# EAGLE design OSWarrior_Mini (EAGLE 6.3)

## Sheet 1 of 3
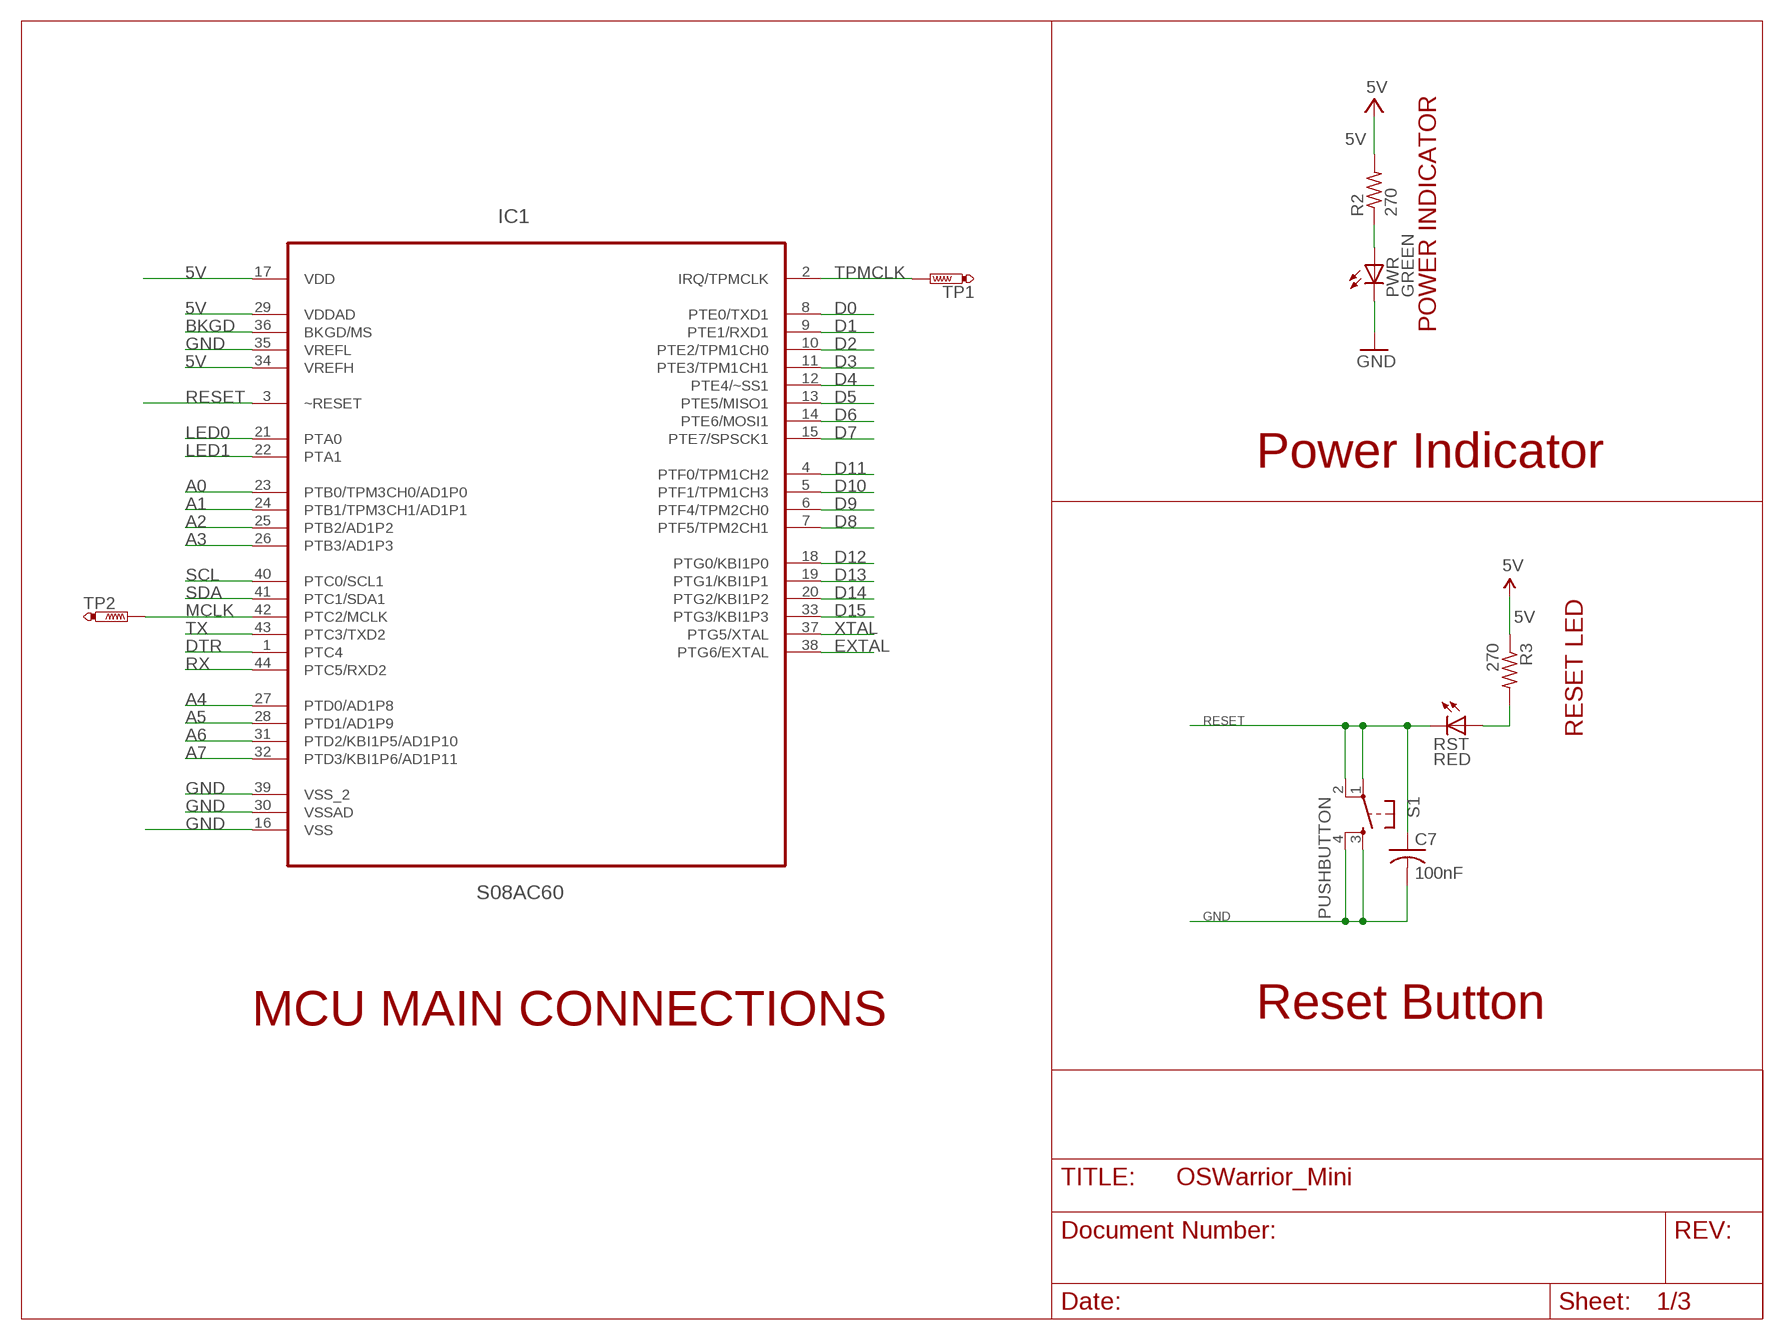
[diagram p0: schematic, sheet 1]

### Parts
C7  100nF  C-USC0805  [C0805]
IC1  S08AC60  MC9S08AC48CFGE_LQFP-44  [LQFP-44]
PWR  GREEN  LEDCHIPLED_1206  [CHIPLED_1206]
R2  270  R-US_M0805  [M0805]
R3  270  R-US_M0805  [M0805]
RST  RED  LEDCHIPLED_1206  [CHIPLED_1206]
S1  PUSHBUTTON  TAC_SWITCHPTH  [TACTILE-PTH]
TP1  PTR1B1,27  [B1,27]
TP2  PTR1B1,27  [B1,27]

### Nets
5V: IC1.17(VDD) IC1.29(VDDAD) IC1.34(VREFH) R2.2 R3.1 ; also sheet 2,3
A0: IC1.23(PTB0/TPM3CH0/AD1P0) ; also sheet 2
A1: IC1.24(PTB1/TPM3CH1/AD1P1) ; also sheet 2
A2: IC1.25(PTB2/AD1P2) ; also sheet 2
A3: IC1.26(PTB3/AD1P3) ; also sheet 2
A4: IC1.27(PTD0/AD1P8) ; also sheet 2
A5: IC1.28(PTD1/AD1P9) ; also sheet 2
A6: IC1.31(PTD2/KBI1P5/AD1P10) ; also sheet 2
A7: IC1.32(PTD3/KBI1P6/AD1P11) ; also sheet 2
BKGD: IC1.36(BKGD/MS) ; also sheet 3
D0: IC1.8(PTE0/TXD1) ; also sheet 2
D1: IC1.9(PTE1/RXD1) ; also sheet 2
D2: IC1.10(PTE2/TPM1CH0) ; also sheet 2
D3: IC1.11(PTE3/TPM1CH1) ; also sheet 2
D4: IC1.12(PTE4/~SS1) ; also sheet 2
D5: IC1.13(PTE5/MISO1) ; also sheet 2
D6: IC1.14(PTE6/MOSI1) ; also sheet 2
D7: IC1.15(PTE7/SPSCK1) ; also sheet 2
D8: IC1.7(PTF5/TPM2CH1) ; also sheet 2
D9: IC1.6(PTF4/TPM2CH0) ; also sheet 2
D10: IC1.5(PTF1/TPM1CH3) ; also sheet 2
D11: IC1.4(PTF0/TPM1CH2) ; also sheet 2
D12: IC1.18(PTG0/KBI1P0) ; also sheet 2
D13: IC1.19(PTG1/KBI1P1) ; also sheet 2
D14: IC1.20(PTG2/KBI1P2) ; also sheet 2
D15: IC1.33(PTG3/KBI1P3) ; also sheet 2
DTR: IC1.1(PTC4)
EXTAL: IC1.38(PTG6/EXTAL) ; also sheet 2
GND [gnd]: C7.2 IC1.16(VSS) IC1.30(VSSAD) IC1.35(VREFL) IC1.39(VSS_2) PWR.C S1.3 S1.4 ; also sheet 2,3
LED0: IC1.21(PTA0) ; also sheet 2
LED1: IC1.22(PTA1) ; also sheet 2
MCLK: IC1.42(PTC2/MCLK) TP2.TP
N$9: R3.2 RST.A
N$14: PWR.A R2.1
RESET: C7.1 IC1.3(~RESET) RST.C S1.1 S1.2 ; also sheet 2,3
RX: IC1.44(PTC5/RXD2) ; also sheet 3
SCL: IC1.40(PTC0/SCL1) ; also sheet 2
SDA: IC1.41(PTC1/SDA1) ; also sheet 2
TPMCLK: IC1.2(IRQ/TPMCLK) TP1.TP
TX: IC1.43(PTC3/TXD2) ; also sheet 3
XTAL: IC1.37(PTG5/XTAL) ; also sheet 2

### Notes on the sheet
- POWER INDICATOR
- Power Indicator
- RESET LED
- MCU MAIN CONNECTIONS | Reset Button

## Sheet 2 of 3
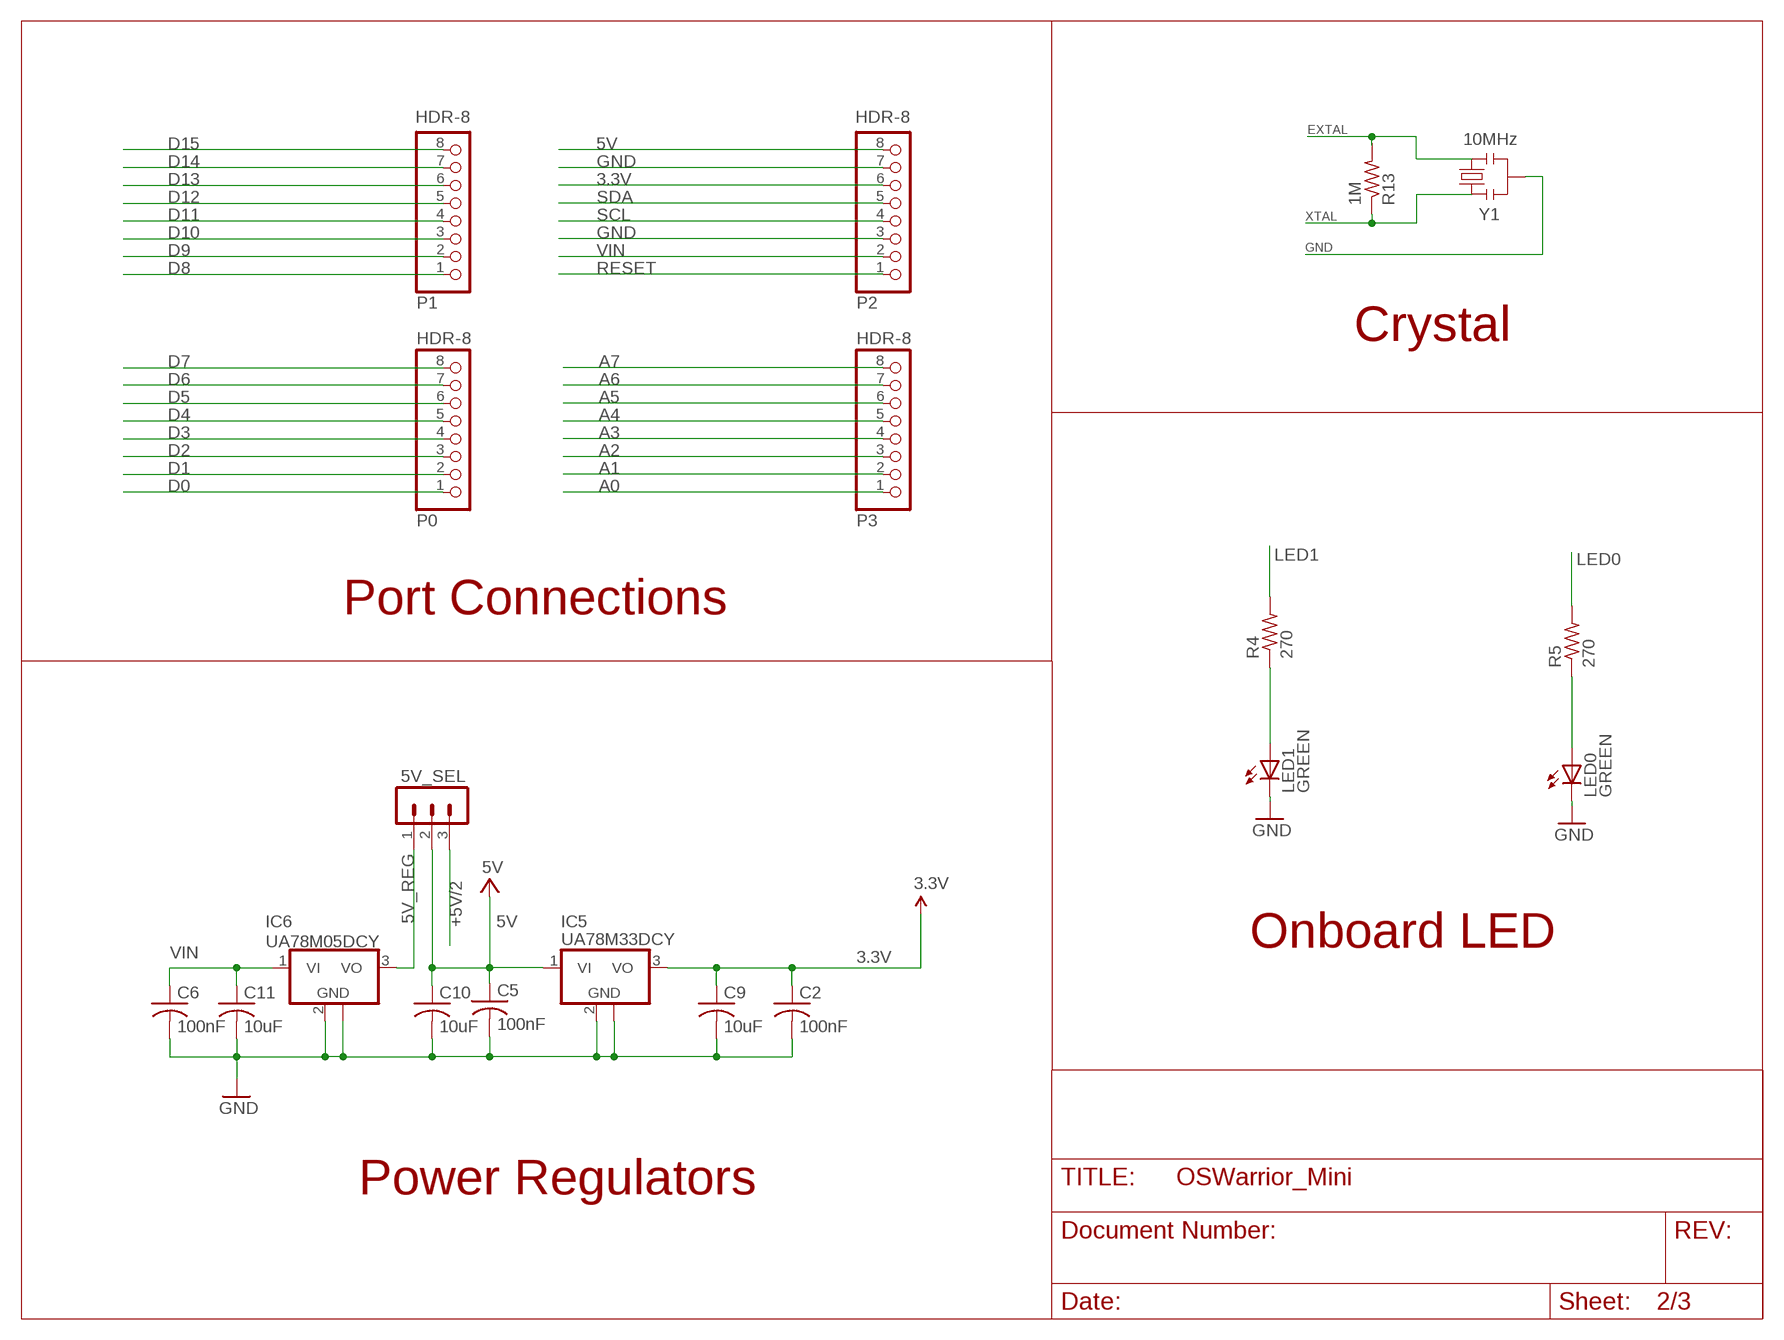
[diagram p1: schematic, sheet 2]

### Parts
5V_SEL  J1  MA03-1  [MA03-1]
C2  100nF  C-USC0805  [C0805]
C5  100nF  C-USC0805  [C0805]
C6  100nF  C-USC0805  [C0805]
C9  10uF  C-USC0805  [C0805]
C10  10uF  C-USC0805  [C0805]
C11  10uF  C-USC0805  [C0805]
IC5  UA78M33DCY  [SOT223]
IC6  UA78M05DCY  [SOT223]
LED0  GREEN  LEDCHIPLED_1206  [CHIPLED_1206]
LED1  GREEN  LEDCHIPLED_1206  [CHIPLED_1206]
P0  HDR-8  PINHD-1X8  [1X08]
P1  HDR-8  PINHD-1X8  [1X08]
P2  HDR-8  PINHD-1X8  [1X08]
P3  HDR-8  PINHD-1X8  [1X08]
R4  270  R-US_M0805  [M0805]
R5  270  R-US_M0805  [M0805]
R13  1M  R-US_M0805  [M0805]
Y1  10MHz  RESONATORSMD  [RESONATOR-SMD]

### Nets
3.3V [usbvcc]: C2.1 C9.1 IC5.3(VO) P2.6
5V: 5V_SEL.2 C5.1 C10.1 IC5.1(VI) P2.8 ; also sheet 1,3
5V_REG [usbvcc]: 5V_SEL.1 IC6.3(VO)
+5V/2: 5V_SEL.3 ; also sheet 3
A0: P3.1 ; also sheet 1
A1: P3.2 ; also sheet 1
A2: P3.3 ; also sheet 1
A3: P3.4 ; also sheet 1
A4: P3.5 ; also sheet 1
A5: P3.6 ; also sheet 1
A6: P3.7 ; also sheet 1
A7: P3.8 ; also sheet 1
D0: P0.1 ; also sheet 1
D1: P0.2 ; also sheet 1
D2: P0.3 ; also sheet 1
D3: P0.4 ; also sheet 1
D4: P0.5 ; also sheet 1
D5: P0.6 ; also sheet 1
D6: P0.7 ; also sheet 1
D7: P0.8 ; also sheet 1
D8: P1.1 ; also sheet 1
D9: P1.2 ; also sheet 1
D10: P1.3 ; also sheet 1
D11: P1.4 ; also sheet 1
D12: P1.5 ; also sheet 1
D13: P1.6 ; also sheet 1
D14: P1.7 ; also sheet 1
D15: P1.8 ; also sheet 1
EXTAL: R13.2 Y1.3 ; also sheet 1
GND [gnd]: C2.2 C5.2 C6.2 C9.2 C10.2 C11.2 IC5.2(GND) IC5.4(GND) IC6.2(GND) IC6.4(GND) LED0.C LED1.C P2.3 P2.7 Y1.2 ; also sheet 1,3
LED0: R5.2 ; also sheet 1
LED1: R4.2 ; also sheet 1
N$6: LED1.A R4.1
N$8: LED0.A R5.1
RESET: P2.1 ; also sheet 1,3
SCL: P2.4 ; also sheet 1
SDA: P2.5 ; also sheet 1
VIN [power]: C6.1 C11.1 IC6.1(VI) P2.2
XTAL: R13.1 Y1.1 ; also sheet 1

### Notes on the sheet
- Crystal
- Port Connections
- Onboard LED
- Power Regulators

## Sheet 3 of 3
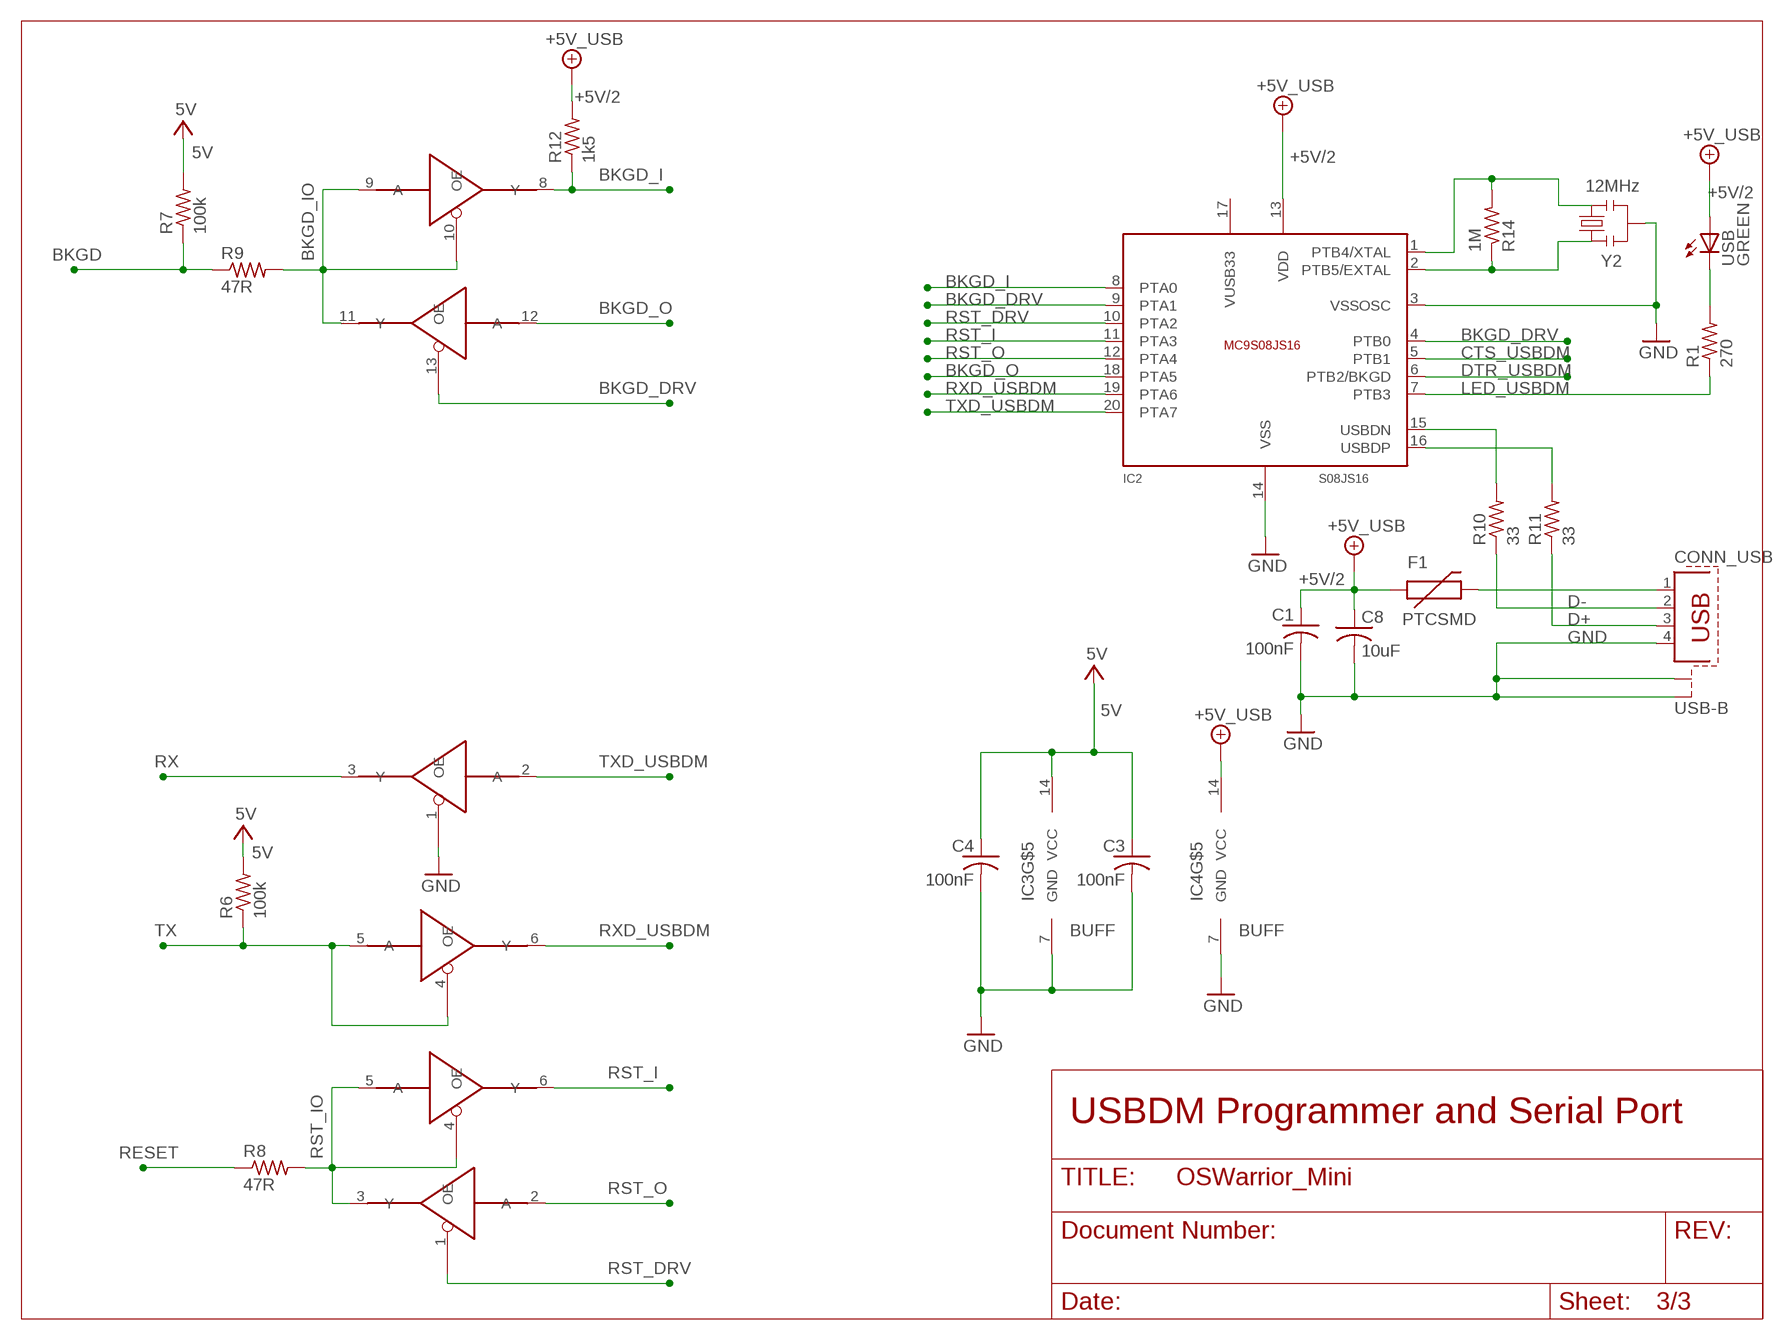
[diagram p2: schematic, sheet 3]

### Parts
C1  100nF  C-USC0805  [C0805]
C3  100nF  C-USC0805  [C0805]
C4  100nF  C-USC0805  [C0805]
C8  10uF  C-USC0805  [C0805]
CONN_USB  USB-B  PN61729-S  [PN61729-S]
F1  PTCSMD  [PTC-1206]
IC2  S08JS16  MC9S08JS16CWJ_SOIC-20  [SOIC-20]
IC3  BUFF  SN74LV125APW_TSSOP-14  [TSSOP-14]
IC4  BUFF  SN74LV125APW_TSSOP-14  [TSSOP-14]
R1  270  R-US_M0805  [M0805]
R6  100k  R-US_M0805  [M0805]
R7  100k  R-US_M0805  [M0805]
R8  47R  R-US_M0805  [M0805]
R9  47R  R-US_M0805  [M0805]
R10  33  R-US_M0805  [M0805]
R11  33  R-US_M0805  [M0805]
R12  1k5  R-US_M0805  [M0805]
R14  1M  R-US_M0805  [M0805]
USB  GREEN  LEDCHIPLED_1206  [CHIPLED_1206]
Y2  12MHz  RESONATORSMD  [RESONATOR-SMD]

### Nets
5V: C3.1 C4.1 IC3.14(VCC) R6.2 R7.2 ; also sheet 1,2
+5V/2: C1.1 C8.1 F1.1 IC2.13(VDD) IC4.14(VCC) R12.2 USB.A ; supply symbol labelled +5V_USB ; also sheet 2
BKGD: R7.1 R9.1 ; also sheet 1
BKGD_DRV: IC2.4(PTB0) IC2.9(PTA1) IC4.13(OE)
BKGD_I: IC2.8(PTA0) IC4.8(Y) R12.1
BKGD_IO: IC4.9(A) IC4.10(OE) IC4.11(Y) R9.2
BKGD_O: IC2.18(PTA5) IC4.12(A)
CTS_USBDM: IC2.5(PTB1)
D+: CONN_USB.3 R11.1
D-: CONN_USB.2 R10.1
DTR_USBDM: IC2.6(PTB2/BKGD)
GND [gnd]: C1.2 C3.2 C4.2 C8.2 CONN_USB.4 CONN_USB.S1 CONN_USB.S2 IC2.3(VSSOSC) IC2.14(VSS) IC3.1(OE) IC3.7(GND) IC4.7(GND) Y2.2 ; also sheet 1,2
LED_USBDM: IC2.7(PTB3) R1.1
N$1: R1.2 USB.C
N$2: IC2.15(USBDN) R10.2
N$3: IC2.16(USBDP) R11.2
N$4: IC2.1(PTB4/XTAL) R14.2 Y2.3
N$5: CONN_USB.1 F1.2
N$7: IC2.2(PTB5/EXTAL) R14.1 Y2.1
RESET: R8.1 ; also sheet 1,2
RST_DRV: IC2.10(PTA2) IC4.1(OE)
RST_I: IC2.11(PTA3) IC4.6(Y)
RST_IO: IC4.3(Y) IC4.4(OE) IC4.5(A) R8.2
RST_O: IC2.12(PTA4) IC4.2(A)
RX: IC3.3(Y) ; also sheet 1
RXD_USBDM: IC2.19(PTA6) IC3.6(Y)
TX: IC3.4(OE) IC3.5(A) R6.1 ; also sheet 1
TXD_USBDM: IC2.20(PTA7) IC3.2(A)
Unconnected: IC3.8(Y) IC3.9(A) IC3.10(OE) IC3.11(Y) IC3.12(A) IC3.13(OE)

### Notes on the sheet
- USBDM Programmer and Serial Port

## Power pins joined to a net without a drawn wire
VUSB33: IC2.17(VUSB33)

## Library data of the parts
5V_SEL = con-lstb:MA03-1: PIN HEADER; OC_FARNELL: unknown; OC_NEWARK: unknown
C1-C11 = resistor:C-US: CAPACITOR, American symbol
CONN_USB = con-berg:PN61729-S: BERG USB connector; OC_FARNELL: unknown; OC_NEWARK: unknown
F1 = SparkFun:PTC: Resettable Fuse PTC Resettable Fuse. Spark Fun Electronics SKU : COM-08357
IC1 = OSWarrior:MC9S08AC48CFGE_LQFP-44
IC2 = OSWarrior:MC9S08JS16CWJ_SOIC-20
IC3 IC4 = OSWarrior:SN74LV125APW_TSSOP-14
IC5 IC6 = linear:UA78M*: POSITIVE-VOLTAGE REGULATORS Source: http://focus.ti.com/lit/ds/symlink/ua78m33.pdf
LED0 LED1 PWR RST USB = led:LED: LED OSRAM: - CHIPLED LG R971, LG N971, LY N971, LG Q971, LY Q971, LO R971, LY R971 LH N974, LH R974 LS Q976, LO Q976, LY Q976 LO Q996 - Hyper CHIPLED LW Q18S LB Q993, LB Q99A, LB R99A - SideLED LS A670, LO A670, LY A670, LG A670, LP A670 LB A673, LV A673, LT A673, LW A673 LH A674 LY A675 LS A676, LA A676, LO A676, LY A676, LW A676 LS A679, LY A679, LG A679 - Hyper Micro SIDELED® LS Y876, LA Y876, LO Y876, LY Y876 LT Y87S - SmartLED LW L88C, LW L88S LB L89C, LB L89S, LG L890 LS L89K, LO L89K, LY L89K LS L896, LA L896, LO L896, LY L896 - TOPLED LS T670, LO T670, LY T670, LG T670, LP T670 LSG T670, LSP T670, LSY T670, LOP T670, LYG T670 LG T671, LOG T671, LSG T671 LB T673, LV T673, LT T673, LW T673 LH T674 LS T676, LA T676, LO T676, LY T676, LB T676, LH T676, LSB T676, LW T676 LB T67C, LV T67C, LT T67C, LS T67K, LO T67K, LY T67K, LW E67C LS E67B, LA E67B, LO E67B, LY E67B, LB E67C, LV E67C, LT E67C LW T67C LS T679, LY T679, LG T679 LS T770, LO T770, LY T770, LG T770, LP T770 LB T773, LV T773, LT T773, LW T773 LH T774 LS E675, LA E675, LY E675, LS T675 LS T776, LA T776, LO T776, LY T776, LB T776 LHGB T686 LT T68C, LB T68C - Hyper Mini TOPLED® LB M676 - Mini TOPLED Santana® LG M470 LS M47K, LO M47K, LY M47K Source: http://www.osram.convergy.de LUXEON: - LUMILED® LXK2-PW12-R00, LXK2-PW12-S00, LXK2-PW14-U00, LXK2-PW14-V00 LXK2-PM12-R00, LXK2-PM12-S00, LXK2-PM14-U00 LXK2-PE12-Q00, LXK2-PE12-R00, LXK2-PE12-S00, LXK2-PE14-T00, LXK2-PE14-U00 LXK2-PB12-K00, LXK2-PB12-L00, LXK2-PB12-M00, LXK2-PB14-N00, LXK2-PB14-P00, LXK2-PB14-Q00 LXK2-PR12-L00, LXK2-PR12-M00, LXK2-PR14-Q00, LXK2-PR14-R00 LXK2-PD12-Q00, LXK2-PD12-R00, LXK2-PD12-S00 LXK2-PH12-R00, LXK2-PH12-S00 LXK2-PL12-P00, LXK2-PL12-Q00, LXK2-PL12-R00 Source: www.luxeon.com KINGBRIGHT: KA-3528ASYC Source: www.kingbright.com
P0 P1-P3 = pinhead:PINHD-1X8: PIN HEADER
R1-R14 = resistor:R-US_: RESISTOR, American symbol
S1 = SparkFun:TAC_SWITCH: Momentary Switch Button commonly used for reset or general input. Spark Fun Electronics SKU : COM-00097
TP1 TP2 = testpad:PTR1: TEST PIN
Y1 Y2 = SparkFun:RESONATOR: Resonator Small SMD resonator. This is the itty bitty 10/20MHz resonators with built in caps. CSTCE10M0G55 and CSTCE20M0V53. Footprint has been reviewed closely but hasn't been tested yet.

## Net classes
0 default: width 0.406 mm
1 power: width 0.61 mm, drill 0.61 mm, clearance 0.254 mm
2 gnd: width 0.305 mm, drill 0.559 mm, clearance 0.254 mm
3 usbvcc: width 0.508 mm, drill 0.61 mm, clearance 0.254 mm
4 aref: width 0.406 mm, drill 0.61 mm, clearance 0.254 mm

## Board
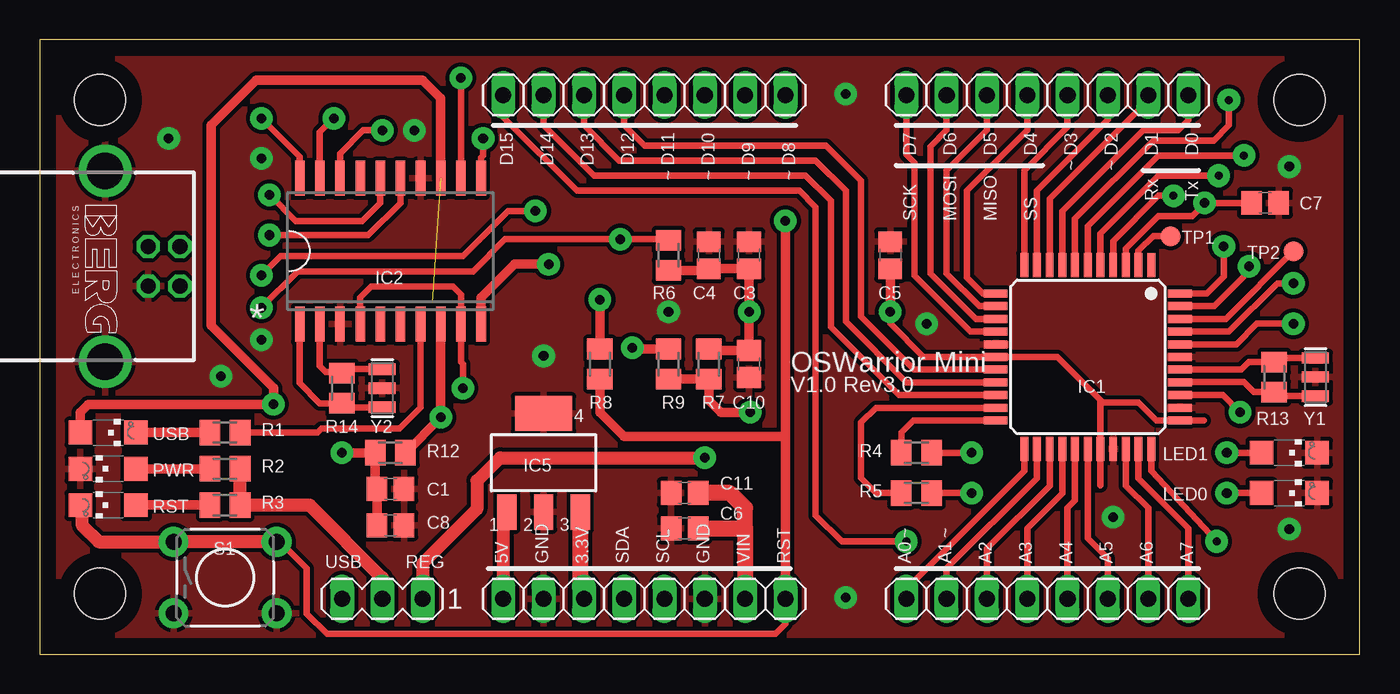
[diagram p3: board, top side]
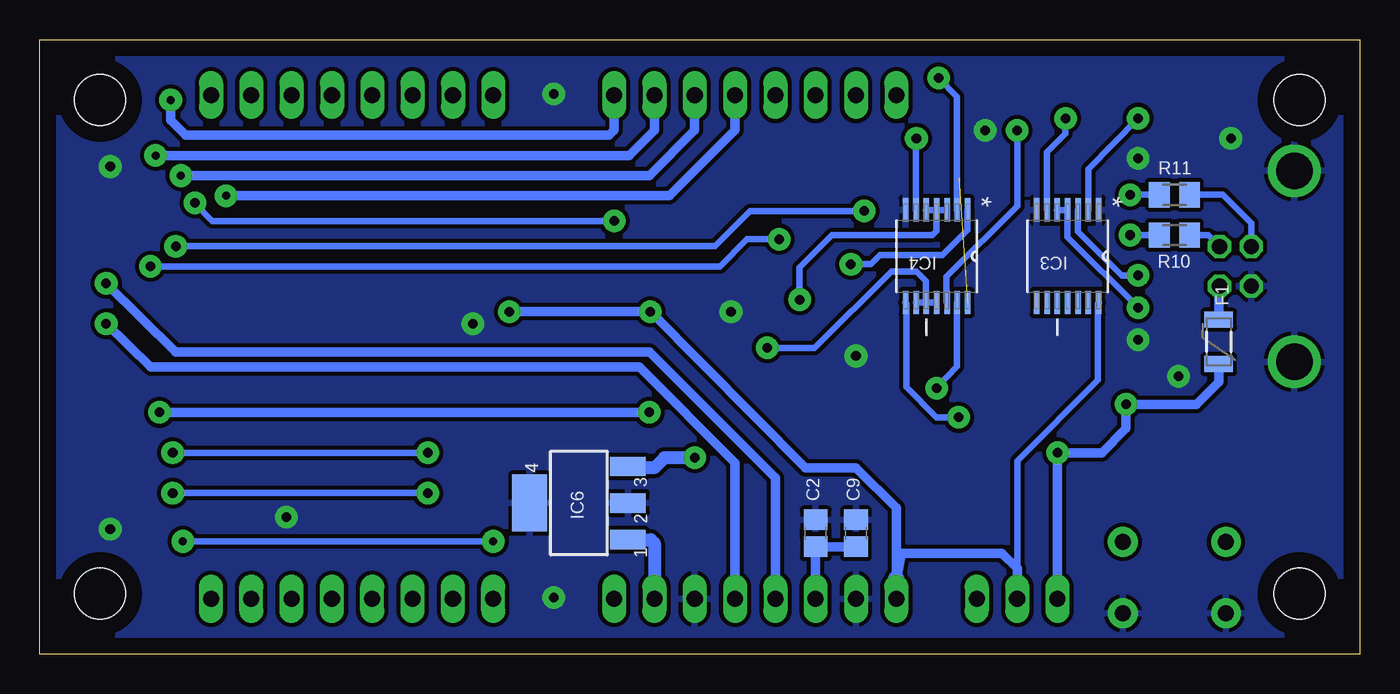
[diagram p4: board, bottom side, seen from below]

Size 83.19 x 38.73 mm. Coordinates in mm from the lower left corner, seen from the top.
Outline: 0,0 83.19,0 83.19,38.73 0,38.73 0,0
Copper layers (1*16): Top 0.035mm / dielectric 1.5mm / Bottom 0.035mm
Design rules "default": minimum track width 10mil, minimum drill 24mil, track to track 8mil, track to pad 8mil, pad to pad 8mil, via to via 8mil, smd to smd 8mil, copper to edge 40mil, drill to drill 8mil, minimum pad ring 10mil, minimum via ring 8mil, stop-mask expansion 4mil, vias tented up to drill 0mil, thermal gap 10mil
Holes 3.2 mm at 3.81,3.81 79.38,3.81 3.81,34.92 79.38,34.92

### Footprints (pad centres in the part's own frame; a part is rotated, then mirrored left to right if it is on the bottom)
MA03-1 = drill 1.016 long: 1 -2.54,0; 2 0,0; 3 2.54,0
C0805 = smd 1.3 x 1.5: 1 -0.85,0; 2 0.85,0
PN61729-S = drill 0.95 octagon: 1 1.25,4.71; 2 -1.25,4.71; 3 -1.25,2.71; 4 1.25,2.71 | drill 2.3 pad 2.9: S1 -6.02,0; S2 6.02,0
PTC-1206 = smd 1 x 1.8: 1 -1.4,0; 2 1.4,0
LQFP-44 = smd 1.5 x 0.5: 1 -5.8,4; 2 -5.8,3.2; 3 -5.8,2.4; 4 -5.8,1.6; 5 -5.8,0.8; 6 -5.8,0; 7 -5.8,-0.8; 8 -5.8,-1.6; 9 -5.8,-2.4; 10 -5.8,-3.2; 11 -5.8,-4; 23 5.8,-4; 24 5.8,-3.2; 25 5.8,-2.4; 26 5.8,-1.6; 27 5.8,-0.8; 28 5.8,0; 29 5.8,0.8; 30 5.8,1.6; 31 5.8,2.4; 32 5.8,3.2; 33 5.8,4 | smd 0.5 x 1.5: 12 -4,-5.8; 13 -3.2,-5.8; 14 -2.4,-5.8; 15 -1.6,-5.8; 16 -0.8,-5.8; 17 0,-5.8; 18 0.8,-5.8; 19 1.6,-5.8; 20 2.4,-5.8; 21 3.2,-5.8; 22 4,-5.8; 34 4,5.8; 35 3.2,5.8; 36 2.4,5.8; 37 1.6,5.8; 38 0.8,5.8; 39 0,5.8; 40 -0.8,5.8; 41 -1.6,5.8; 42 -2.4,5.8; 43 -3.2,5.8; 44 -4,5.8
SOIC-20 = smd 0.6 x 2.2: 1 -5.715,-4.6; 2 -4.445,-4.6; 3 -3.175,-4.6; 4 -1.905,-4.6; 5 -0.635,-4.6; 6 0.635,-4.6; 7 1.905,-4.6; 8 3.175,-4.6; 9 4.445,-4.6; 10 5.715,-4.6; 11 5.715,4.6; 12 4.445,4.6; 13 3.175,4.6; 14 1.905,4.6; 15 0.635,4.6; 16 -0.635,4.6; 17 -1.905,4.6; 18 -3.175,4.6; 19 -4.445,4.6; 20 -5.715,4.6
TSSOP-14 = smd 1.473 x 0.356: 1 -2.921,1.956; 2 -2.921,1.295; 3 -2.921,0.66; 4 -2.921,0; 5 -2.921,-0.66; 6 -2.921,-1.295; 7 -2.921,-1.956; 8 2.921,-1.956; 9 2.921,-1.295; 10 2.921,-0.66; 11 2.921,0; 12 2.921,0.66; 13 2.921,1.295; 14 2.921,1.956
SOT223 = smd 1.219 x 2.235: 1 -2.311,-3.099; 2 0,-3.099; 3 2.311,-3.099 | smd 3.6 x 2.2: 4 0,3.099
CHIPLED_1206 = smd 1.5 x 1.5: A 0,-1.75; C 0,1.75
1X08 = drill 1.016 long: 1 -8.89,0; 2 -6.35,0; 3 -3.81,0; 4 -1.27,0; 5 1.27,0; 6 3.81,0; 7 6.35,0; 8 8.89,0
M0805 = smd 1.3 x 1.6: 1 -0.95,0; 2 0.95,0
TACTILE-PTH = drill 1.016 pad 1.88: 1 -3.251,2.261; 2 3.251,2.261; 3 -3.251,-2.261; 4 3.251,-2.261
B1,27 = smd 1.27 x 1.27: TP 0,0
RESONATOR-SMD = smd 0.7 x 1.7: 1 -1.2,0; 2 0,0; 3 1.2,0

### Placement (x,y rotation side)
5V_SEL  21.59,3.49 180 top
C1  22.1,10.41 0 top
C2  34.29,7.62 90 bottom
C3  44.7,25.15 90 top
C4  42.16,25.15 90 top
C5  53.59,25.15 90 top
C6  40.64,7.94 180 top
C7  77.22,28.45 0 top
C8  22.1,8.13 0 top
C9  31.75,7.62 90 bottom
C10  44.7,18.29 270 top
C11  40.64,10.16 180 top
CONN_USB  4.13,24.45 270 top
F1  8.89,19.68 90 bottom
IC1  66.04,18.73 270 top
IC2  22.1,25.4 0 top
IC3  18.41,25.08 270 bottom
IC4  26.67,25.08 270 bottom
IC5  31.75,12.06 0 top
IC6  49.21,9.53 90 bottom
LED0  78.74,10.16 270 top
LED1  78.74,12.7 270 top
P0  63.5,35.24 180 top
P1  38.1,35.24 180 top
P2  38.1,3.49 180 top
P3  63.5,3.49 0 top
PWR  4.32,11.68 90 top
R1  11.68,13.97 180 top
R2  11.68,11.68 0 top
R3  11.68,9.4 180 top
R4  55.24,12.7 180 top
R5  55.24,10.16 180 top
R6  39.62,25.15 270 top
R7  42.16,18.29 90 top
R8  35.31,18.29 90 top
R9  39.62,18.29 90 top
R10  11.68,26.42 180 bottom
R11  11.68,28.96 180 bottom
R12  22.1,12.7 180 top
R13  77.79,17.46 90 top
R14  19.05,16.76 270 top
RST  4.32,9.4 90 top
S1  11.68,4.83 0 top
TP1  71.25,26.35 0 top
TP2  78.99,25.4 0 top
USB  4.32,13.97 270 top
Y1  80.39,17.46 90 top
Y2  21.59,16.76 270 top

### Tracks (layer width: path | path; a pad name or v marks a point on that pad's centre or on a via)
3.3V
  Top 1.016: IC5.3 34.06,3.72 P2.6
  Bottom 0.61: C9.1 C2.1 P2.6
5V  (via drill 0.6 pad 1.42)
  Top 0.406: 66.84,14.45 IC1.29 | 66.84,16.03 64.14,18.73 IC1.17 55.69,18.73 53.59,20.83 v53.59,21.59 | 66.84,16.03 IC1.29 | 73.34,14.73 IC1.34 70.36,14.73 69.22,15.88 66.99,15.88 66.84,16.03 | 66.84,10.63 IC1.29
  Top 0.61: R7.2 42.26,19.14 C10.1 v44.7,21.59 C3.1 C4.1 42.06,24.2 R6.2 | C5.1 v53.59,21.59
  Top 0.813: IC5.1 29.21,8.01 P2.8 | 5V_SEL.2 21.59,4.83 17.02,9.4 R3.1 R2.2
  Bottom 0.406: IC3.14 16.51,22.11 16.51,17.27 21.59,12.19 5V_SEL.2
  Bottom 0.61: P2.8 29.21,9.21 31.75,11.75 34.92,11.75 v44.7,21.59 v53.59,21.59 | 5V_SEL.2 21.59,5.4 22.54,6.35 28.89,6.35 29.21,4.76
  Bottom 1.016: 29.21,4.76 P2.8
5V_REG  (via drill 0.6 pad 1.42)
  Top 0.813: v41.91,12.38 29.02,12.38 27.56,10.92 27.56,9.14 24.13,5.71 5V_SEL.1
  Bottom 0.813: v41.91,12.38 43.81,12.38 44.45,11.75 46.34,11.75 IC6.3
+5V/2  (via drill 0.6 pad 1.42)  (1 unrouted)
  Top 0.61: v19.05,12.7 R12.2 21.15,10.51 C1.1 C8.1 | USB.A 2.54,14.51 2.54,15.24 3.05,15.75 v14.73,15.75 14.73,16.76 10.79,20.7 10.79,33.34 13.65,36.2 24.13,36.2 25.27,35.05 IC2.13
  Bottom 0.61: 5V_SEL.3 v19.05,12.7 16.26,12.7 14.73,14.22 v14.73,15.75 10.29,15.75 8.89,17.14 F1.1
A0
  Top 0.406: P3.1 54.61,4.13 62.04,11.56 IC1.23
A1
  Top 0.406: P3.2 57.15,5.4 62.84,11.09 IC1.24
A2
  Top 0.406: P3.3 59.69,6.67 63.64,10.62 IC1.25
A3
  Top 0.406: P3.4 62.23,7.94 64.44,10.15 IC1.26
A4
  Top 0.406: P3.5 64.77,9.21 65.24,9.68 IC1.27
A5
  Top 0.406: IC1.28 66.04,7.3 67.31,6.03 P3.6
A6
  Top 0.406: P3.7 69.85,9.21 68.44,10.62 IC1.31
A7
  Top 0.406: P3.8 72.39,7.94 69.24,11.09 IC1.32
BKGD  (via drill 0.6 pad 1.42)
  Top 0.406: IC1.36 74.54,16.33 v75.63,15.24
  Top 0.61: v44.77,15.24 42.93,15.24 42.16,16 R7.1 R9.1
  Bottom 0.61: v75.63,15.24 v44.77,15.24
BKGD_DRV  (via drill 0.6 pad 1.42)
  Top 0.406: v26.67,16.76 26.67,18.29 26.54,18.41 IC2.9 26.54,22.67 26.04,23.18 20.89,23.18 20.19,22.48 IC2.4
  Bottom 0.406: IC4.13 25.38,18.12 v26.67,16.76
BKGD_I  (via drill 0.6 pad 1.42)
  Top 0.61: R12.1 v25.27,14.93 IC2.8
  Bottom 0.406: IC4.8 28.57,22.11 28.57,16.83 26.67,14.93 v25.27,14.93
BKGD_IO  (via drill 0.6 pad 1.42)
  Top 0.61: v37.34,19.3 37.4,19.24 R9.2
  Bottom 0.406: IC4.9 IC4.10 | IC4.10 IC4.11 | IC4.10 27.33,23.52 27.94,24.13 29.53,24.13 34.35,19.3 v37.34,19.3
BKGD_O  (via drill 0.6 pad 1.42)
  Top 0.406: v21.59,33.02 20.38,33.02 18.92,31.56 IC2.18
  Bottom 0.406: IC4.12 26.04,22.19 26.04,23.81 21.59,28.26 v21.59,33.02
D0
  Top 0.406: 72.39,34.3 P0.1 72.39,33.66 71.75,33.02 69.53,33.02 64.44,27.93 IC1.8
D1
  Top 0.406: IC1.9 63.64,28.71 69.85,34.92 P0.2
D2
  Top 0.406: IC1.10 62.84,29.21 67.31,33.68 P0.3
D3
  Top 0.406: IC1.11 62.04,30.48 64.77,33.21 P0.4
D4
  Top 0.406: IC1.12 59.44,22.73 58.42,23.75 58.42,29.21 62.23,33.02 P0.5
D5
  Top 0.406: IC1.13 59.22,21.93 57.15,24 57.15,30.48 59.69,33.02 P0.6
D6
  Top 0.406: IC1.14 59.01,21.13 56.13,24 56.13,32 57.15,33.02 P0.7
D7
  Top 0.406: IC1.15 58.66,20.33 55.12,23.88 55.12,30.99 54.61,31.5 P0.8
D8  (via drill 0.5 pad 1.42)
  Top 0.406: IC1.7 65.24,27.46 70.17,32.38 73.98,32.38 74.93,33.34 v74.93,34.92
  Bottom 0.61: P1.1 46.99,33.02 47.31,32.7 73.98,32.7 74.93,33.66 v74.93,34.92
D9  (via drill 0.5 pad 1.42)
  Top 0.406: IC1.6 66.04,26.99 70.48,31.43 v75.88,31.43
  Bottom 0.61: P1.2 44.45,33.02 46.04,31.43 v75.88,31.43
D10  (via drill 0.5 pad 1.42)
  Top 0.406: IC1.5 66.84,26.52 70.48,30.16 v74.3,30.16
  Bottom 0.61: P1.3 41.91,33.02 44.77,30.16 v74.3,30.16
D11  (via drill 0.5 pad 1.42)
  Top 0.406: IC1.4 67.64,26.05 70.48,28.89 v71.44,28.89
  Bottom 0.61: P1.4 39.37,33.02 43.5,28.89 v71.44,28.89
D12
  Top 0.406: IC1.18 55.09,17.93 51.75,21.27 51.75,29.84 49.53,32.07 38.1,32.07 36.83,33.34 P1.5
D13
  Top 0.406: IC1.19 54.62,17.13 50.8,20.95 50.8,29.21 48.9,31.11 36.51,31.11 34.29,33.34 P1.6
D14
  Top 0.406: IC1.20 54.15,16.33 49.85,20.64 49.85,28.57 48.26,30.16 34.92,30.16 31.75,33.34 P1.7
D15  (via drill 0.5 pad 1.42)
  Top 0.406: v74.17,7.11 70.04,11.56 IC1.33 | P1.8 29.21,33.85 33.85,29.21 47.88,29.21 48.9,28.19 48.9,8.76 50.55,7.11 v54.61,7.11
  Bottom 0.406: v54.61,7.11 v74.17,7.11
D+
  Bottom 0.406: CONN_USB.3 6.84,27.16 8.64,28.96 R11.1
D-
  Bottom 0.406: CONN_USB.2 9.56,26.42 R10.1
EXTAL
  Top 0.406: IC1.38 75.72,17.93 76.2,18.41 R13.2 78.04,18.66 Y1.3
GND  (via drill 0.6 pad 1.42)
  other vias: 8.13,32.51 13.97,31.24 13.97,19.81 23.62,33.02 78.74,30.73 78.74,7.87 67.63,8.64 50.8,3.56 50.8,35.31 39.62,21.59 31.75,18.8 11.43,17.53 55.88,20.83
  pour Top: 0,0 83.19,0 83.19,38.73 0,38.73
  pour Bottom: 0,0 83.19,0 83.19,38.73 0,38.73
LED0
  Top 0.406: IC1.21 52.68,15.53 51.75,14.61 51.75,11.11 52.7,10.16 R5.2
LED1
  Top 0.406: IC1.22 55.05,14.73 54.29,13.97 R4.2
LED_USBDM
  Top 0.406: IC2.7 24,15.56 22.67,14.22 17.78,14.22 17.53,13.97 R1.1
MCLK
  Top 0.406: IC1.42 74.73,21.13 TP2.TP
N$1
  Top 0.61: USB.C R1.2
N$2  (via drill 0.6 pad 1.42)
  Top 0.406: IC2.15 22.73,28.45 20.7,26.42 v14.48,26.42
  Bottom 0.406: R10.2 v14.48,26.42
N$3  (via drill 0.6 pad 1.42)
  Top 0.406: v14.48,28.96 16.13,27.3 20.32,27.3 21.46,28.45 IC2.16
  Bottom 0.406: R11.2 v14.48,28.96
N$4
  Top 0.406: R14.2 19.62,15.63 | R14.2 17.65,15.81 16.38,17.08 IC2.1 | Y2.3 19.3,15.56 arc-90 R14.2
N$5
  Bottom 0.61: F1.2 8.89,23.14 CONN_USB.1
N$6  (via drill 0.6 pad 1.42)
  Top 0.406: v74.8,12.7 LED1.A | R4.1 v58.74,12.7
  Bottom 0.406: v58.74,12.7 v74.8,12.7
N$7
  Top 0.406: R14.1 19.62,18.03 | Y2.1 19.3,17.96 arc90 R14.1 | R14.1 18.98,17.78 18.03,17.78 17.65,18.16 IC2.2
N$8  (via drill 0.6 pad 1.42)
  Top 0.406: v74.8,10.16 LED0.A | R5.1 v58.74,10.16
  Bottom 0.406: v58.74,10.16 v74.8,10.16
N$9
  Top 0.61: RST.A R3.2
N$14
  Top 0.61: PWR.A R2.1
RESET  (via drill 0.6 pad 1.42)
  Top 0.406: IC1.3 68.44,25.58 70.48,27.62 72.64,27.62 v73.41,28.45 C7.1 | P2.1 46.99,1.91 46.35,1.27 18.1,1.27 16.83,2.54 16.83,5.4 15.2,7.02 S1.2
  Top 0.61: P2.1 46.99,13.72 | 46.99,13.72 v46.99,27.3 | R8.1 35.31,15.24 36.83,13.72 46.99,13.72
  Top 0.813: S1.2 S1.1 3.71,7.09 2.69,8.1 2.69,9.27 RST.C
  Bottom 0.406: v73.41,28.45 72.33,27.3 v46.99,27.3
RST_DRV  (via drill 0.6 pad 1.42)
  Top 0.61: v32.07,24.57 29.91,24.57 27.81,22.48 IC2.10
  Bottom 0.406: IC4.1 24.71,26.72 26.29,25.15 30.23,25.15 30.8,24.57 v32.07,24.57
RST_I  (via drill 0.6 pad 1.42)
  Top 0.406: IC2.11 27.81,31.3 27.94,31.43 v27.94,32.51
  Bottom 0.406: IC4.6 27.96,31.46 v27.94,32.51
RST_IO  (via drill 0.6 pad 1.42)
  Top 0.61: R8.2 v35.31,22.35
  Bottom 0.406: IC4.5 IC4.4 | IC4.3 IC4.4 | v35.31,22.35 35.31,24.38 33.27,26.42 26.92,26.42 26.67,26.67 IC4.4
RST_O  (via drill 0.6 pad 1.42)
  Top 0.406: IC2.12 v26.54,36.32
  Bottom 0.406: IC4.2 25.38,35.15 v26.54,36.32
RX  (via drill 0.6 pad 1.42)
  Top 0.406: v74.61,25.72 74.61,23.81 73.53,22.73 IC1.44 | v31.24,27.94 29.53,27.94 26.67,25.08 15.18,25.08 v13.97,23.88
  Bottom 0.406: IC3.3 17.75,26.64 14.99,23.88 v13.97,23.88 | v31.24,27.94 38.42,27.94 40.64,25.72 v74.61,25.72
RXD_USBDM  (via drill 0.6 pad 1.42)
  Top 0.406: IC2.19 17.65,32.89 v18.54,33.78
  Bottom 0.406: IC3.6 19.71,31.65 18.54,32.82 v18.54,33.78
SCL  (via drill 0.6 pad 1.42)
  Top 0.406: IC1.40 75.41,19.53 76.71,20.83 v78.99,20.83
  Bottom 0.61: v78.99,20.83 76.2,18.1 45.4,18.1 39.37,12.06 P2.4
SDA  (via drill 0.6 pad 1.42)
  Top 0.406: 71.85,20.32 IC1.41 74.94,20.33 77.98,23.37 v78.99,23.37
  Bottom 0.61: P2.5 36.83,11.11 44.77,19.05 74.61,19.05 v78.99,23.37
TPMCLK
  Top 0.406: IC1.2 69.24,25.43 70.17,26.35 TP1.TP
TX  (via drill 0.6 pad 1.42)
  Top 0.406: v76.2,24.45 76.2,24.13 74,21.93 IC1.43 | v13.97,21.84 16.26,24.13 27.3,24.13 29.34,26.16 v36.58,26.16 39.56,26.16 R6.1
  Bottom 0.406: IC3.5 IC3.4 18.41,26.29 v13.97,21.84 | v36.58,26.16 38.61,26.16 40.32,24.45 v76.2,24.45
TXD_USBDM  (via drill 0.6 pad 1.42)
  Top 0.406: IC2.20 16.38,31.37 v13.97,33.78
  Bottom 0.406: IC3.2 17.12,30.57 v13.97,33.78
VIN
  Top 1.016: 44.45,7.94 P2.2 | C6.1 44.45,7.94 | 44.45,7.94 44.45,9.21 43.5,10.16 C11.1
  Bottom 0.813: IC6.1 44.68,7.21 44.45,6.99 P2.2
XTAL
  Top 0.406: IC1.37 71.85,17.14 75.88,17.14 76.52,16.51 R13.1 78.04,16.26 Y1.1

### Text on the board
tNames: D15 | D14 | D13 | D12 | D11 | D10 | D9 | D8 | D7 | D6 | D5 | D4 | D3 | D2 | D1 | D0 | ~ | ~ | ~ | ~ | ~ | ~ | Rx | Tx | SCK | MOSI | MISO | SS | OSWarrior Mini | V1.0 Rev3.0 | ~ | ~ | 5V | GND | 3.3V | SDA | SCL | GND | VIN | RST | A0 | A1 | A2 | A3 | A4 | A5 | A6 | A7 | USB | REG